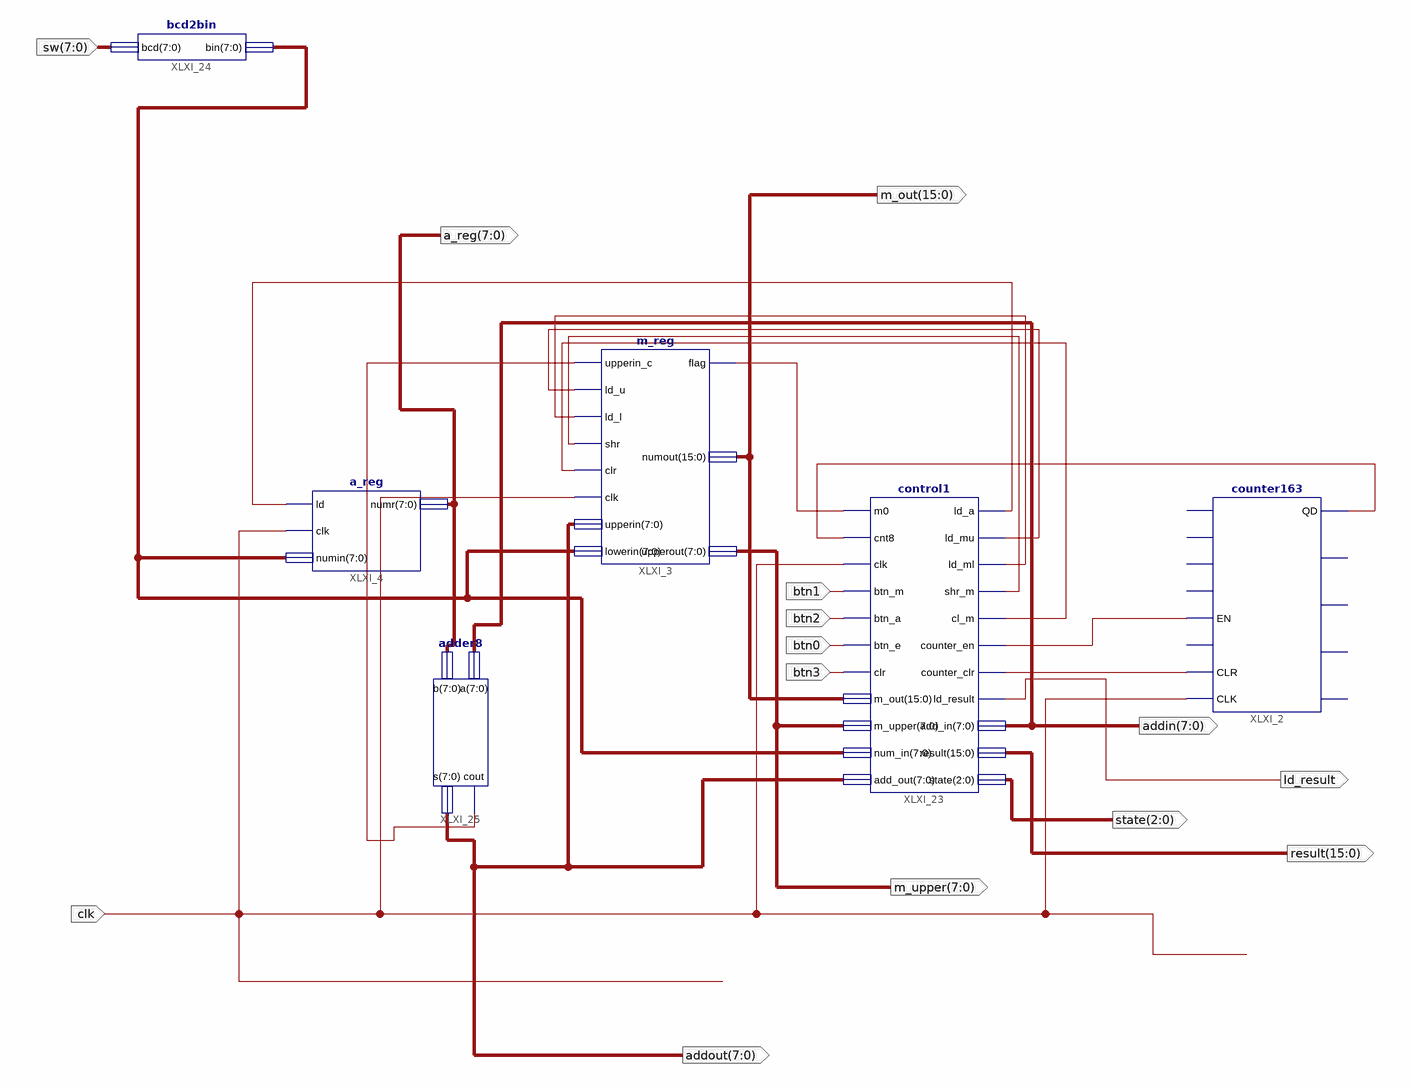
[diagram p0: schematic sheet 1]
// Xilinx ISE schematic calc_test.sch (spartan3e) as structural Verilog: 6 symbols, 14 ports
module calc_test (
  input  clk,
  input  btn1,
  input  btn2,
  input  btn0,
  input  btn3,
  input  [7:0] sw,
  output [7:0] a_reg,
  output [7:0] addin,
  output [15:0] result,
  output ld_result,
  output [2:0] state,
  output [15:0] m_out,
  output [7:0] m_upper,
  output [7:0] addout
);

  wire XLXN_7, XLXN_9, XLXN_12, XLXN_13, XLXN_14, XLXN_21, XLXN_22, XLXN_26, XLXN_27, XLXN_28;
  wire [7:0] XLXN_38;

  counter163 XLXI_2 (.EN(XLXN_21), .CLR(XLXN_22), .CLK(clk), .QD(XLXN_12));  // open: A, B, C, D, LOAD, RCO, QC, QA, QB
  m_reg XLXI_3 (
    .upperin_c(XLXN_7), .ld_u(XLXN_13), .ld_l(XLXN_14), .shr(XLXN_27), .clr(XLXN_28), .clk(clk),
    .upperin(addout), .lowerin(XLXN_38), .flag(XLXN_9), .numout(m_out), .upperout(m_upper));
  a_reg XLXI_4 (.ld(XLXN_26), .clk(clk), .numin(XLXN_38), .numr(a_reg));
  control1 XLXI_23 (
    .m0(XLXN_9), .cnt8(XLXN_12), .clk(clk), .btn_m(btn1), .btn_a(btn2), .btn_e(btn0), .clr(btn3),
    .m_out(m_out), .m_upper(m_upper), .num_in(XLXN_38), .add_out(addout), .ld_a(XLXN_26), .ld_mu(XLXN_13),
    .ld_ml(XLXN_14), .shr_m(XLXN_27), .cl_m(XLXN_28), .counter_en(XLXN_21), .counter_clr(XLXN_22),
    .ld_result(ld_result), .add_in(addin), .result(result), .state(state));
  bcd2bin XLXI_24 (.bcd(sw), .bin(XLXN_38));
  adder8 XLXI_25 (.a(addin), .b(a_reg), .cout(XLXN_7), .s(addout));
endmodule
